# Altium schematic sheet HighSpeedDiffSig.SchDoc
size B; DocumentNumber: 1; SheetNumber: 1; SheetTotal: 10
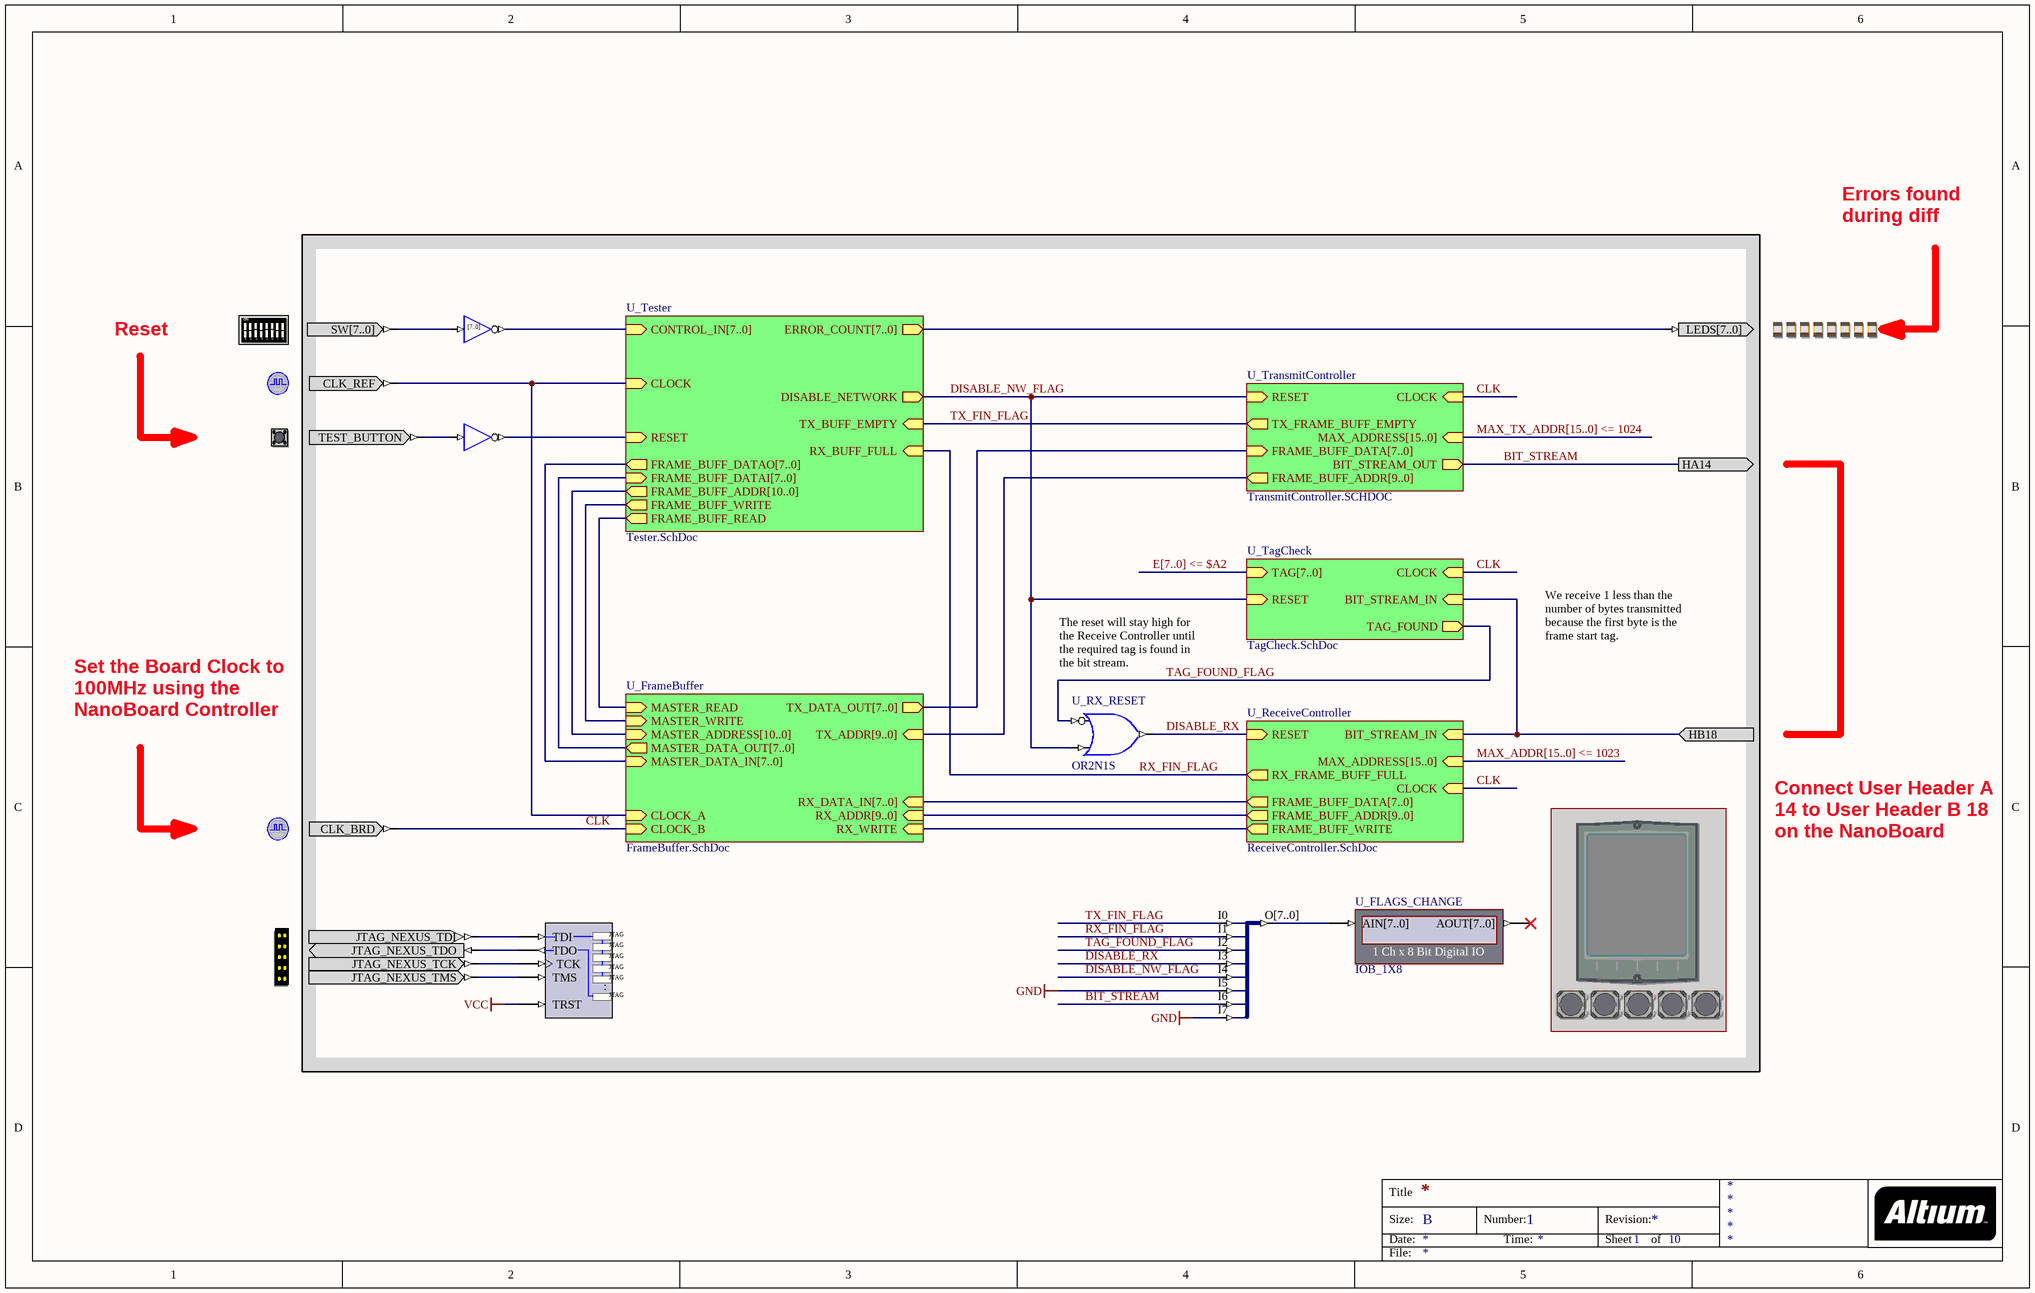
[diagram p0: HighSpeedDiffSig.SchDoc]

## Parts
(Parts that share a designator on the sheet are numbered #1, #2 ... from top to bottom, then left to right.)
?#1  DIPSWITCH  (value not drawn)
?#2  LED  (value not drawn)
?#3  CLOCK_REFERENCE  (value not drawn)
?#4  TEST_BUTTON  (value not drawn)
?#5  CLOCK_BOARD  (value not drawn)
?#6  FIRMWARE_TFT_ENABLE  (value not drawn)  (masked out: inside a compile mask, not in the netlist)
?#7  NEXUS_JTAG_CONNECTOR  (value not drawn)
?#8  FIRMWARE_BUTTONS_ENABLE  (value not drawn)  (masked out: inside a compile mask, not in the netlist)
NEXUS_JTAG_PORT  NEXUS_JTAG_PORT  (value not drawn)
U1  J8S_8B  (value not drawn)
U_FLAGS_CHANGE  IOB_1X8
U_INV_RESET  INV  (value not drawn)
U_INV_TEST_CTRL  INV8B  (value not drawn)
U_RX_RESET  OR2N1S

## Sub-sheets
U_FrameBuffer = FrameBuffer.SchDoc: CLOCK_A (in), MASTER_DATA_IN[7..0] (in), MASTER_DATA_OUT[7..0] (out), MASTER_ADDRESS[10..0] (in), MASTER_WRITE (in), TX_DATA_OUT[7..0] (out), TX_ADDR[9..0] (in), RX_DATA_IN[7..0] (in), RX_ADDR[9..0] (in), RX_WRITE (in), MASTER_READ (in), CLOCK_B (in)
U_ReceiveController = ReceiveController.SchDoc: CLOCK (in), RESET (in), BIT_STREAM_IN (in), FRAME_BUFF_ADDR[9..0] (out), FRAME_BUFF_WRITE (out), FRAME_BUFF_DATA[7..0] (out), RX_FRAME_BUFF_FULL (out), MAX_ADDRESS[15..0] (in)
U_TagCheck = TagCheck.SchDoc: TAG[7..0] (in), CLOCK (in), RESET (in), BIT_STREAM_IN (in), TAG_FOUND (out)
U_Tester = Tester.SchDoc: CLOCK (in), RESET (in), CONTROL_IN[7..0] (in), FRAME_BUFF_DATAO[7..0] (out), FRAME_BUFF_DATAI[7..0] (in), FRAME_BUFF_ADDR[10..0] (out), FRAME_BUFF_WRITE (out), TX_BUFF_EMPTY (in), RX_BUFF_FULL (in), DISABLE_NETWORK (out), FRAME_BUFF_READ (out), ERROR_COUNT[7..0] (out)
U_TransmitController = TransmitController.SCHDOC: CLOCK (in), RESET (in), FRAME_BUFF_ADDR[9..0] (out), FRAME_BUFF_DATA[7..0] (in), BIT_STREAM_OUT (out), TX_FRAME_BUFF_EMPTY (out), MAX_ADDRESS[15..0] (in)

## Ports
HA14 (out), HB18 (in)

## Nets
GND: U1.I5 U1.I7
VCC: NEXUS_JTAG_PORT.TRST
BIT_STREAM: U1.I6 ; port HA14, sheet U_TransmitController/BIT_STREAM_OUT
CLK: ?#5.CLK_BRD ; sheet U_ReceiveController/CLOCK, sheet U_TagCheck/CLOCK, sheet U_TransmitController/CLOCK, sheet U_FrameBuffer/CLOCK_B
DISABLE_NW_FLAG: U1.I4 U_RX_RESET.I1 ; sheet U_Tester/DISABLE_NETWORK, sheet U_TagCheck/RESET, sheet U_TransmitController/RESET
DISABLE_RX: U1.I3 U_RX_RESET.O ; sheet U_ReceiveController/RESET
HB18: port HB18, sheet U_ReceiveController/BIT_STREAM_IN, sheet U_TagCheck/BIT_STREAM_IN
RX_FIN_FLAG: U1.I1 ; sheet U_ReceiveController/RX_FRAME_BUFF_FULL, sheet U_Tester/RX_BUFF_FULL
TAG_FOUND_FLAG: U1.I2 U_RX_RESET.I0 ; sheet U_TagCheck/TAG_FOUND
TX_FIN_FLAG: U1.I0 ; sheet U_Tester/TX_BUFF_EMPTY, sheet U_TransmitController/TX_FRAME_BUFF_EMPTY
Net?#1_SW[7..0]: ?#1.SW[7..0] U_INV_TEST_CTRL.I[7..0]
Net?#2_LEDS[7..0]: ?#2.LEDS[7..0] ; sheet U_Tester/ERROR_COUNT[7..0]
Net?#3_CLK_REF: ?#3.CLK_REF ; sheet U_Tester/CLOCK, sheet U_FrameBuffer/CLOCK_A
Net?#4_TEST_BUTTON: ?#4.TEST_BUTTON U_INV_RESET.I
Net?#7_JTAG_NEXUS_TCK: ?#7.JTAG_NEXUS_TCK NEXUS_JTAG_PORT.TCK
Net?#7_JTAG_NEXUS_TDI: ?#7.JTAG_NEXUS_TDI NEXUS_JTAG_PORT.TDI
Net?#7_JTAG_NEXUS_TDO: ?#7.JTAG_NEXUS_TDO NEXUS_JTAG_PORT.TDO
Net?#7_JTAG_NEXUS_TMS: ?#7.JTAG_NEXUS_TMS NEXUS_JTAG_PORT.TMS
NetU1_O[7..0]: U1.O[7..0] U_FLAGS_CHANGE.AIN[7..0]
NetU_INV_RESET_O: U_INV_RESET.O ; sheet U_Tester/RESET
NetU_INV_TEST_CTRL_O[7..0]: U_INV_TEST_CTRL.O[7..0] ; sheet U_Tester/CONTROL_IN[7..0]
(unnamed): sheet U_ReceiveController/FRAME_BUFF_WRITE, sheet U_FrameBuffer/RX_WRITE
(unnamed): sheet U_Tester/FRAME_BUFF_WRITE, sheet U_FrameBuffer/MASTER_WRITE
(unnamed): sheet U_Tester/FRAME_BUFF_READ, sheet U_FrameBuffer/MASTER_READ

Not connected (* = marked no-connect by the designer): U_FLAGS_CHANGE AOUT[7..0]*

## Buses and harness runs
bus E[7..0] <= $A2 = sheet U_TagCheck/TAG[7..0]
bus MAX_ADDR[15..0] <= 1023 = sheet U_ReceiveController/MAX_ADDRESS[15..0]
bus MAX_TX_ADDR[15..0] <= 1024 = sheet U_TransmitController/MAX_ADDRESS[15..0]
bus sheet U_FrameBuffer/MASTER_ADDRESS[10..0] = sheet U_Tester/FRAME_BUFF_ADDR[10..0]
bus sheet U_FrameBuffer/MASTER_DATA_IN[7..0] = sheet U_Tester/FRAME_BUFF_DATAO[7..0]
bus sheet U_FrameBuffer/MASTER_DATA_OUT[7..0] = sheet U_Tester/FRAME_BUFF_DATAI[7..0]
bus sheet U_FrameBuffer/RX_ADDR[9..0] = sheet U_ReceiveController/FRAME_BUFF_ADDR[9..0]
bus sheet U_FrameBuffer/RX_DATA_IN[7..0] = sheet U_ReceiveController/FRAME_BUFF_DATA[7..0]
bus sheet U_FrameBuffer/TX_ADDR[9..0] = sheet U_TransmitController/FRAME_BUFF_ADDR[9..0]
bus sheet U_FrameBuffer/TX_DATA_OUT[7..0] = sheet U_TransmitController/FRAME_BUFF_DATA[7..0]

## Notes on the sheet
- Errors found during diff
- Reset
- (near U_RX_RESET) The reset will stay high for the Receive Controller until the required tag is found in the bit stream.
- We receive 1 less than the number of bytes transmitted because the first byte is the frame start tag.
- Set the Board Clock to 100MHz using the NanoBoard Controller
- Connect User Header A 14 to User Header B 18 on the NanoBoard
- Title
- Size:
- Date:
- B
- Number:
- Time:
- Revision:
- Sheet
- of
- File:
- (in symbol DIPSWITCH) ON; 1; 2; 3; 4; 5; 6; 7; 8
- (in symbol INV8B) [7..0]
- (in symbol NEXUS_JTAG_PORT) JTAG; .

## Library data of the parts
?#1 = DIPSWITCH: 8-Way Dip-Switch; PortComponent: True; Published: 19-Nov-2003; Publisher: Altium Limited; HelpURL: TR0143 Technical Reference Manual for Altium's Desktop NanoBoard NB2DSK01.pdf#page=51
?#2 = LED: Bank of eight Red LEDs; PortComponent: True; Published: 19-Nov-2003; Publisher: Altium Limited; HelpURL: TR0143 Technical Reference Manual for Altium's Desktop NanoBoard NB2DSK01.pdf#page=51
?#3 = CLOCK_REFERENCE: Global System Clock Reference Supply; PortComponent: True; Published: 19-Nov-2003; Publisher: Altium Limited; HelpURL: TR0143 Technical Reference Manual for Altium's Desktop NanoBoard NB2DSK01.pdf#page=41
?#4 = TEST_BUTTON: Test / Reset Button; PortComponent: True; Published: 19-Nov-2003; Publisher: Altium Limited; HelpURL: TR0143 Technical Reference Manual for Altium's Desktop NanoBoard NB2DSK01.pdf#page=53
?#5 = CLOCK_BOARD: Global System Clock Supply; PortComponent: True; Published: 19-Nov-2003; Publisher: Altium Limited; HelpURL: TR0143 Technical Reference Manual for Altium's Desktop NanoBoard NB2DSK01.pdf#page=41; UseInDSF: True
?#6 = FIRMWARE_TFT_ENABLE: TFT LCD Panel; PortComponent: True; Published: 22-Jan-2007; Publisher: Altium Limited; HelpURL: TR0143 Technical Reference Manual for Altium's Desktop NanoBoard NB2DSK01.pdf#page=50
?#7 = NEXUS_JTAG_CONNECTOR: JTAG Port; PortComponent: True; Published: 19-Nov-2003; Publisher: Altium Limited; HelpURL: TR0102 NanoBoard Technical Reference Manual - NB1.pdf#page=33
?#8 = FIRMWARE_BUTTONS_ENABLE: Generic User Buttons; PortComponent: True; Published: 16-Apr-2007; Publisher: Altium Limited; HelpURL: TR0143 Technical Reference Manual for Altium's Desktop NanoBoard NB2DSK01.pdf#page=53
NEXUS_JTAG_PORT = NEXUS_JTAG_PORT: Soft Nexus-Chain Connector; NEXUS_JTAG_CONNECTOR: True; Published: 18-Dec-2003; Publisher: Altium Limited
U1 = J8S_8B: 8 Single pin inputs to single 8-Bit output bus; FunctionalClass: Bus Joiner; PortSize: 8; ArchiveName: GENERIC; VHDLIB_SIM: GENERIC_LIB; Published: 29-Jan-2004; Publisher: Altium Limited; LastRevisionNo: 1.00.00; HelpURL: CR0118 FPGA Generic Library Guide.pdf#page=305
U_FLAGS_CHANGE = IOB_1X8: 1 Ch x 8 Bit Digital IO; NEXUS_CORE: Instrument; NEXUS_JTAG_DEVICE: True; NEXUS_JTAG_ORDER: 0; Published: 3-Nov-2004; Publisher: Altium Limited; LastRevisionNo: 1.00.00; HelpURL: CR0102 IOB_x Digital IO Module.pdf#page=2
U_INV_RESET = INV: Inverter; ArchiveName: GENERIC; VHDLIB_SIM: GENERIC_LIB; Published: 29-Jan-2004; Publisher: Altium Limited; Xilinx Equivalent: INV; Core Revision: 1.00.00
U_INV_TEST_CTRL = INV8B: 8-Bit Inverter, Bus Version; ArchiveName: GENERIC; VHDLIB_SIM: GENERIC_LIB; Published: 29-Jan-2004; Publisher: Altium Limited; Core Revision: 1.00.00
U_RX_RESET = OR2N1S: 2-Input OR Gate with Active Low A Input, Single Pin Version; Xilinx Equivalent: OR2B1; ArchiveName: GENERIC; VHDLIB_SIM: GENERIC_LIB; Published: 29-Jan-2004; Publisher: Altium Limited; Core Revision: 1.00.00